# EAGLE design alt-promo (EAGLE 5.10)
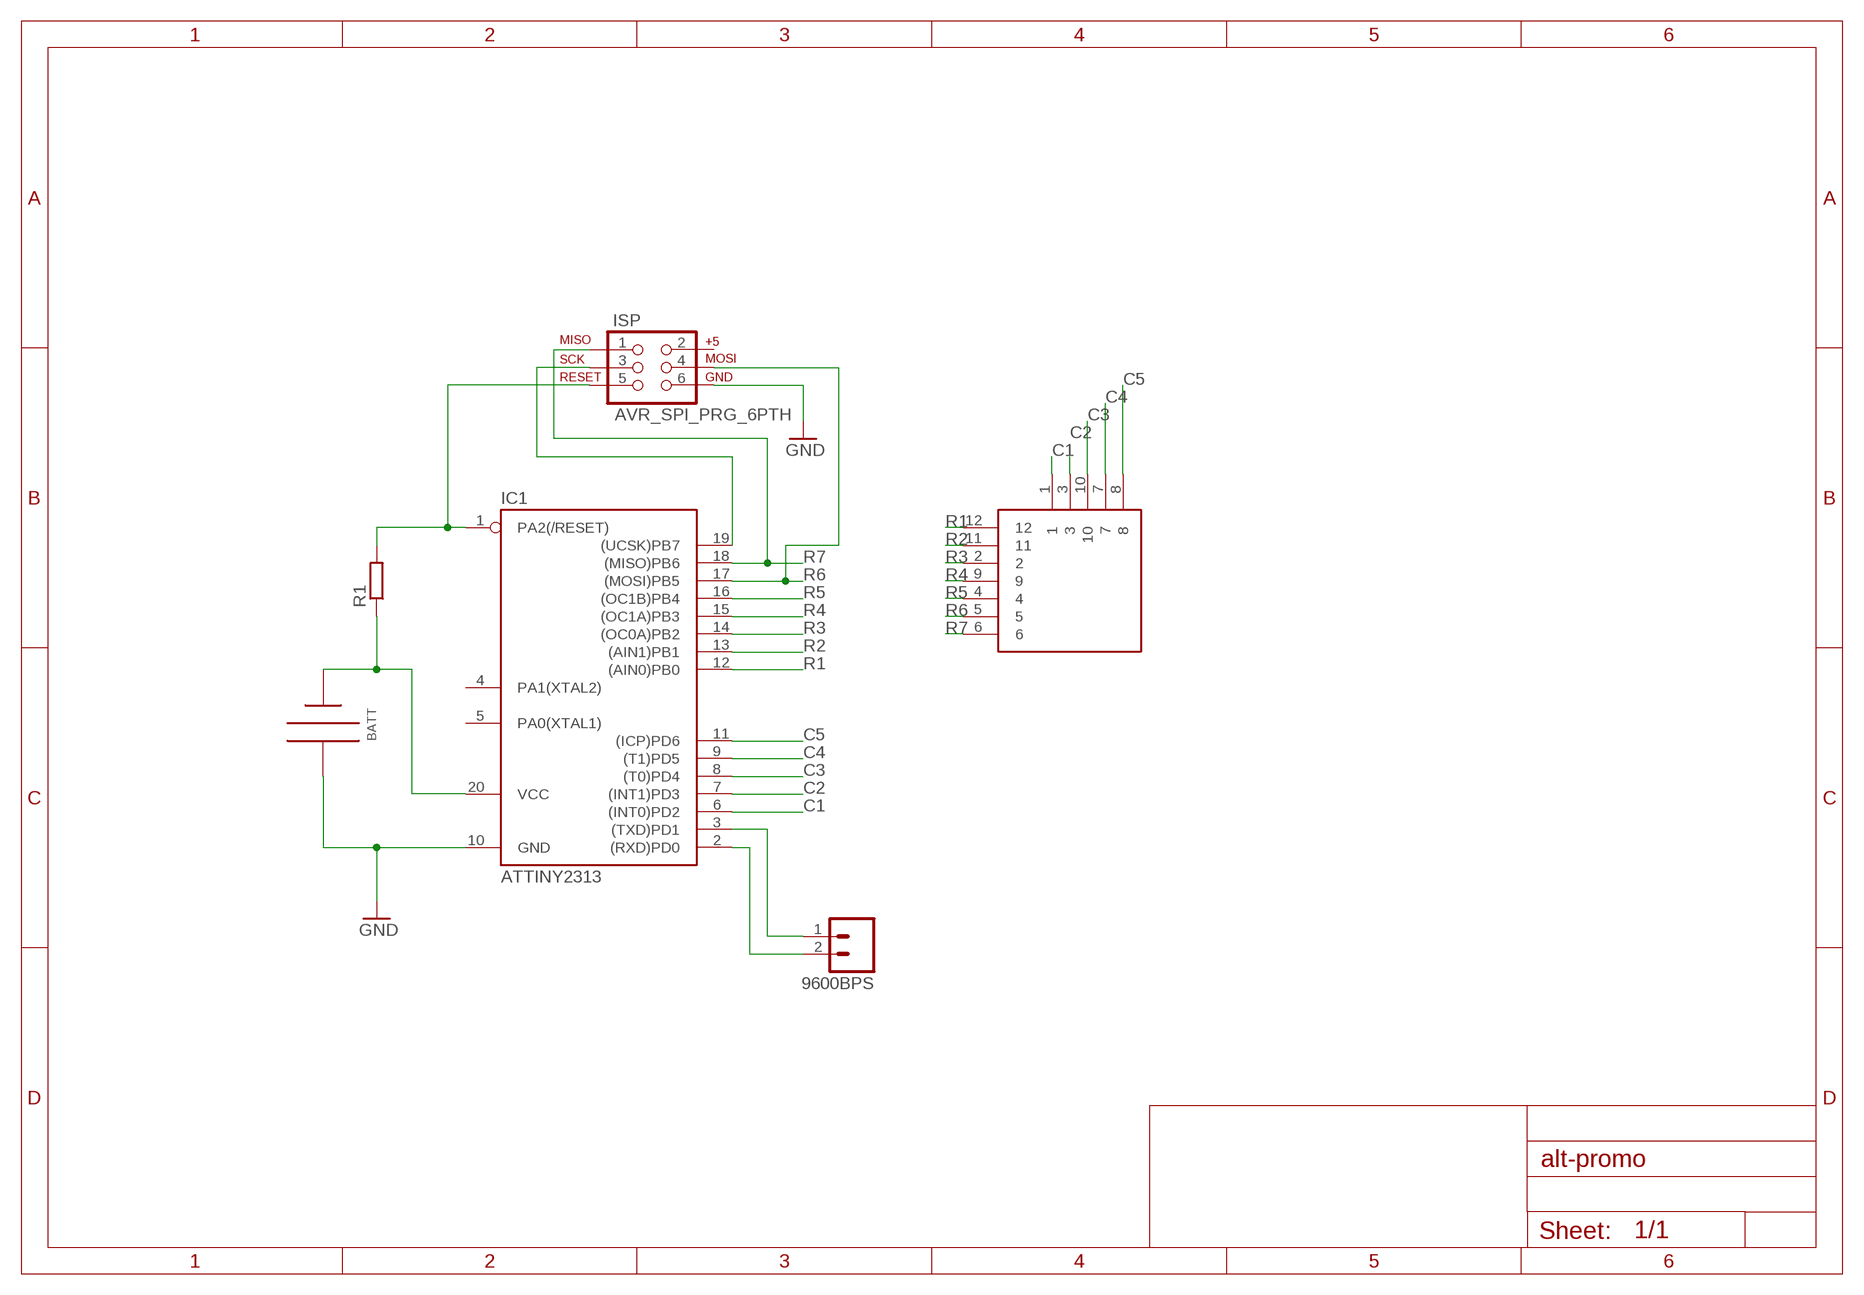
[diagram p0: schematic, sheet 1]

## Parts
9600BPS  M02PTH  [1X02]
IC1  ATTINY2313  TINY2313-*P*  [DIL20]
ISP  AVR_SPI_PRG_6PTH  [2X3]
LED  LED_MATRIX_1.9MM_5X7  [LED_MATRIX_5X7_1.9MM]
R1  R-EU_0207/10  [0207/10]
U$1  BAT_HOLDER_20MM  [BAT_HOLDER_20MM_VERT]

## Nets
C1: IC1.6((INT0)PD2) LED.1
C2: IC1.7((INT1)PD3) LED.3
C3: IC1.8((T0)PD4) LED.10
C4: IC1.9((T1)PD5) LED.7
C5: IC1.11((ICP)PD6) LED.8
GND: IC1.10(GND) ISP.6 U$1.GND
N$1: IC1.20(VCC) R1.1 U$1.VCC
N$3: IC1.1(PA2(/RESET)) ISP.5 R1.2
N$5: IC1.19((UCSK)PB7) ISP.3
N$6: 9600BPS.2 IC1.2((RXD)PD0)
N$7: 9600BPS.1 IC1.3((TXD)PD1)
R1: IC1.12((AIN0)PB0) LED.12
R2: IC1.13((AIN1)PB1) LED.11
R3: IC1.14((OC0A)PB2) LED.2
R4: IC1.15((OC1A)PB3) LED.9
R5: IC1.16((OC1B)PB4) LED.4
R6: IC1.17((MOSI)PB5) ISP.4 LED.5
R7: IC1.18((MISO)PB6) ISP.1 LED.6
Unconnected: IC1.4(PA1(XTAL2)) IC1.5(PA0(XTAL1)) ISP.2

## Library data of the parts
9600BPS = SparkFun:M02: Header 2 Standard 2-pin 0.1" header. Use with straight break away headers (SKU : PRT-00116), right angle break away headers (PRT-00553), swiss pins (PRT-00743), machine pins (PRT-00117), and female headers (PRT-00115). Molex polarized connector foot print use with SKU : PRT-08233 with associated crimp pins and housings.
IC1 = avr-6:TINY2313*: Atmel Tiny2313 2K Flash, 128 bytes EEPROM, 128 bytes RAM
ISP = SparkFun:AVR_SPI_PRG_6: AVR ISP 6 Pin This is the reduced ISP connector for AVR programming. Common on Arduino. This footprint will take up less PCB space and can be used with a 10-pin to 6-pin adapter such as SKU: BOB-08508
LED = sivu:LED_MATRIX_1.9MM_5X7
R1 = resistor:R-EU_: RESISTOR, European symbol
U$1 = sivu:BAT_HOLDER_20MM

## Net classes
0 default: width 0.254 mm, drill 0.254 mm, clearance 0.254 mm

## Board
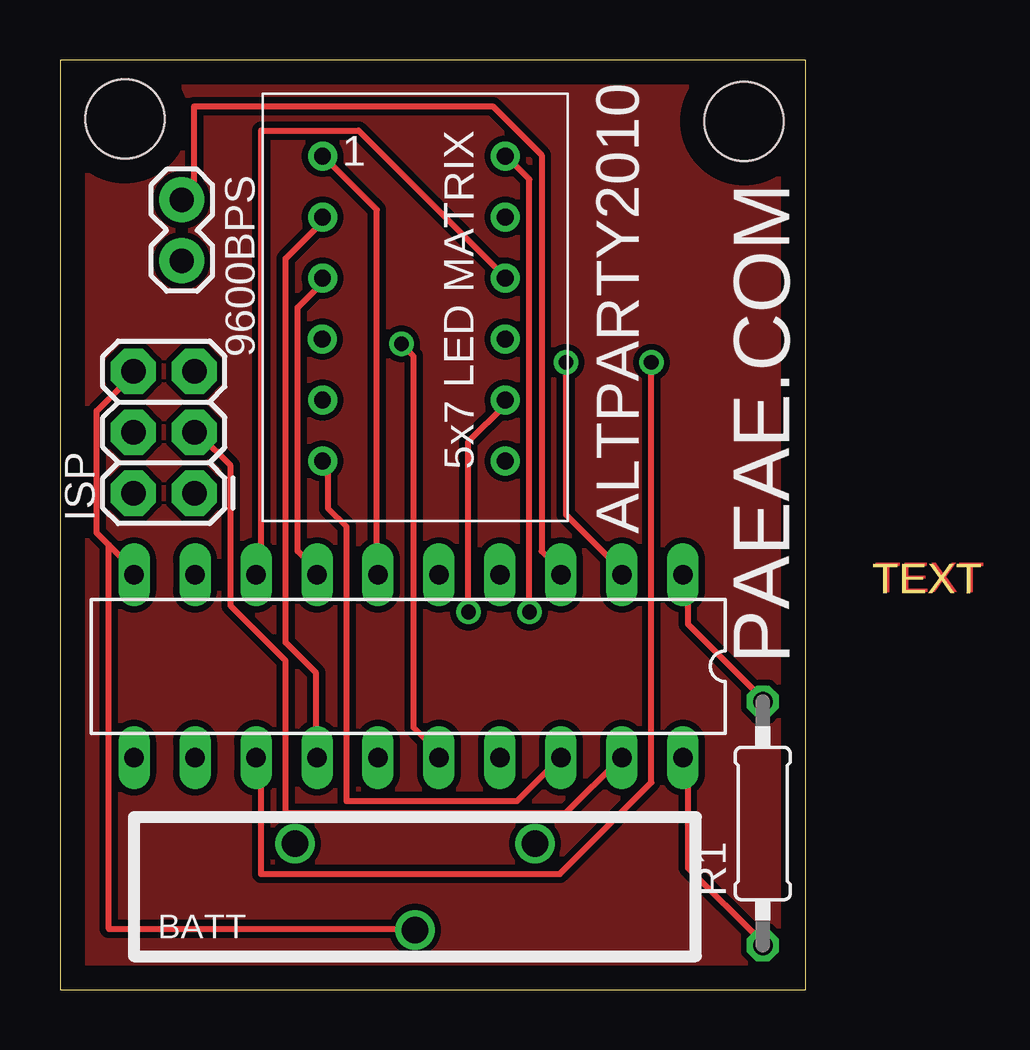
[diagram p1: board, top side]
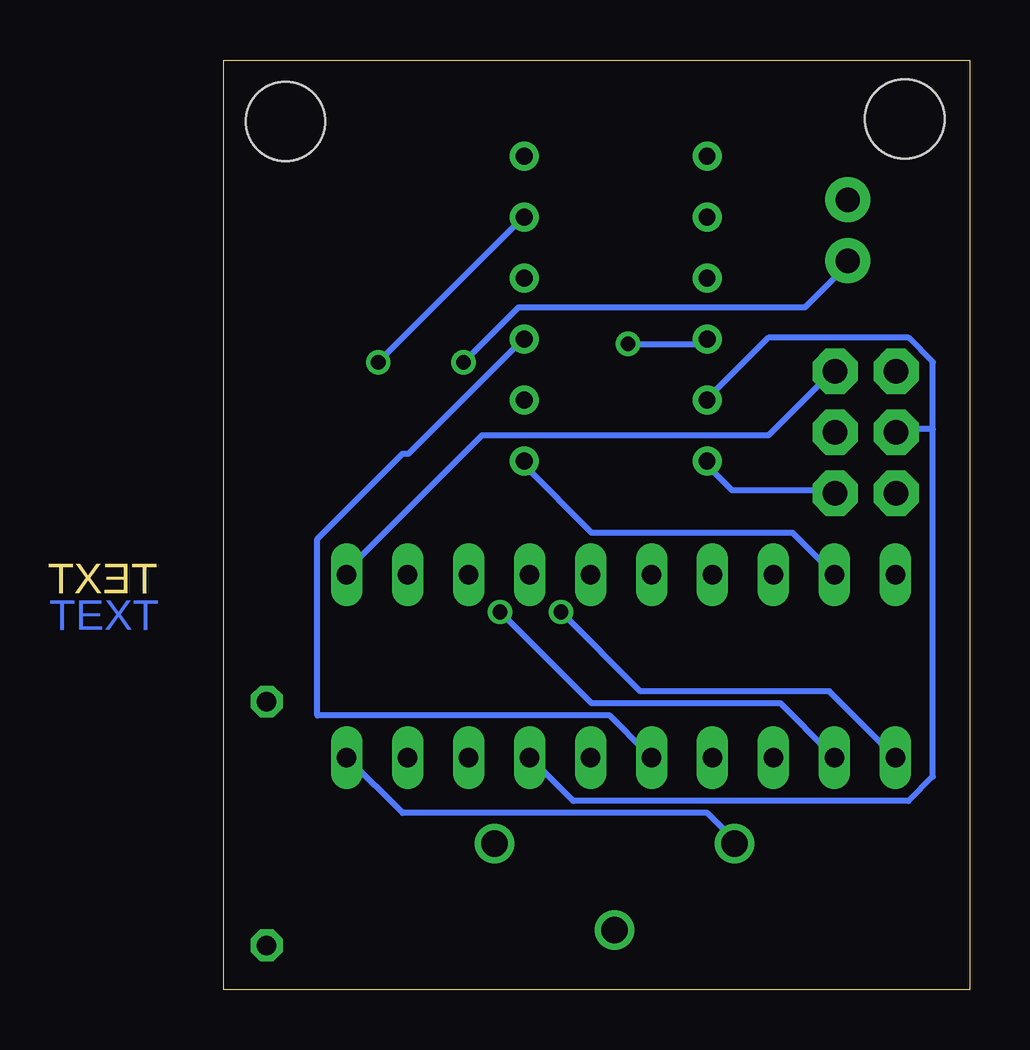
[diagram p2: board, bottom side, seen from below]

Size 31.08 x 38.77 mm. Coordinates in mm from the lower left corner, seen from the top.
Outline: 0,0.01 31.08,0 31.08,38.76 0,38.77 0,0.01
Copper layers (1*16): Top 0.035mm / dielectric 1.5mm / Bottom 0.035mm
Design rules "10mils": minimum track width 10mil, minimum drill 24mil, track to track 10mil, track to pad 10mil, pad to pad 10mil, via to via 10mil, smd to smd 10mil, copper to edge 40mil, drill to drill 10mil, minimum pad ring 10mil, minimum via ring 8mil, stop-mask expansion 0mil, vias tented up to drill 0mil, thermal gap 10mil
Holes 3.3 mm at 2.7,36.31 28.5,36.21

### Footprints (pad centres in the part's own frame; a part is rotated, then mirrored left to right if it is on the bottom)
1X02 = drill 1.016 pad 1.88 round: 1 0,0; 2 2.54,0
DIL20 = drill 0.813 long: 1 -11.43,-3.81; 2 -8.89,-3.81; 3 -6.35,-3.81; 4 -3.81,-3.81; 5 -1.27,-3.81; 6 1.27,-3.81; 7 3.81,-3.81; 8 6.35,-3.81; 9 8.89,-3.81; 10 11.43,-3.81; 11 11.43,3.81; 12 8.89,3.81; 13 6.35,3.81; 14 3.81,3.81; 15 1.27,3.81; 16 -1.27,3.81; 17 -3.81,3.81; 18 -6.35,3.81; 19 -8.89,3.81; 20 -11.43,3.81
2X3 = drill 1.016 pad 1.88 octagon: 1 0,0; 2 0,2.54; 3 2.54,0; 4 2.54,2.54; 5 5.08,0; 6 5.08,2.54
LED_MATRIX_5X7_1.9MM = drill 0.7 round: 1 -3.81,6.35; 2 -3.81,3.81; 3 -3.81,1.27; 4 -3.82,-1.27; 5 -3.81,-3.81; 6 -3.81,-6.35; 7 3.81,-6.35; 8 3.81,-3.81; 9 3.8,-1.27; 10 3.81,1.27; 11 3.81,3.81; 12 3.81,6.35
0207/10 = drill 0.813 octagon: 1 -5.08,0; 2 5.08,0
BAT_HOLDER_20MM_VERT = drill 1.1 round: GND 1.1,11.7; NC 4.7,6.7; VCC 4.7,16.7

### Placement (x,y rotation side)
9600BPS  5.08,32.94 270 top
IC1  14.52,13.5 180 top
ISP  5.6,20.71 90 top
LED  14.75,28.41 0 top
R1  29.28,6.94 90 top
U$1  26.49,1.41 90 top

### Tracks (layer width: path | path; a pad name or v marks a point on that pad's centre or on a via)
C1
  Top 0.254: LED.1 11.18,34.55 13.21,32.52 13.21,17.54 IC1.6
C2
  Top 0.254: LED.3 10.92,29.47 9.91,28.46 9.91,18.3 10.67,17.54 IC1.7
C3
  Top 0.254: LED.10 18.54,29.73 12.45,35.82 8.38,35.82 8.38,17.54 IC1.8
C4
  Bottom 0.254: LED.7 18.54,21.85 15.75,19.06 7.37,19.06 5.84,17.54 IC1.9
C5  (via drill 0.61)
  Top 0.254: v17.02,15.76 17.02,22.87 18.54,24.39 LED.8
  Bottom 0.254: v17.02,15.76 13.72,12.46 5.84,12.46 3.3,9.92 IC1.11
GND
  Top 0.254: 2.03,18.55 1.52,19.06 1.52,24.14 3.05,25.66 ISP.6 | 2.03,18.55 3.05,17.54 IC1.10 | 2.03,18.55 2.03,2.55 14.73,2.55 U$1.GND
N$1
  Top 0.254: R1.1 29.21,2.04 26.16,5.09 26.16,9.66 IC1.20
  Bottom 0.254: U$1.VCC 9.91,6.36 10.92,7.38 23.62,7.38 25.91,9.66 IC1.20
N$2
  pour Top: 0,38.73 31.14,38.73 31.14,0.01 0,0.01
N$3
  Top 0.254: R1.2 29.21,12.2 26.16,15.25 26.16,17.28 IC1.1
  Bottom 0.254: ISP.5 5.84,25.66 8.38,23.12 20.32,23.12 25.91,17.54 IC1.1
N$5
  Top 0.254: IC1.19 23.37,9.66 21.08,7.38 9.4,7.38 9.4,13.73 7.11,16.01 7.11,21.85 5.84,23.12 ISP.3
N$6  (via drill 0.61)
  Top 0.254: v21.08,26.17 21.08,19.82 23.37,17.54 IC1.2
  Bottom 0.254: v21.08,26.17 18.8,28.46 6.86,28.46 5.08,30.24 9600BPS.2
N$7
  Top 0.254: IC1.3 20.83,17.54 20.07,18.3 20.07,34.81 18.03,36.84 5.59,36.84 5.59,33.54 5.08,33.03 9600BPS.1
R1  (via drill 0.61)
  Top 0.254: v19.56,15.76 19.56,33.79 18.8,34.55 LED.12
  Bottom 0.254: v19.56,15.76 15.75,11.95 7.87,11.95 5.84,9.92 IC1.12
R2  (via drill 0.61)
  Top 0.254: v24.64,26.17 24.64,8.65 20.83,4.84 8.38,4.84 8.38,9.66 IC1.13
  Bottom 0.254: v24.64,26.17 18.8,32.01 LED.11
R3
  Top 0.254: LED.2 10.92,32.01 9.4,30.49 9.4,14.49 10.67,13.22 10.67,9.92 IC1.14
R4
  Bottom 0.254: LED.9 18.8,26.93 23.37,22.36 23.62,22.36 27.18,18.81 27.18,11.44 14.99,11.44 13.46,9.92 IC1.15
R5  (via drill 0.61)
  Top 0.254: v14.22,26.93 14.73,26.43 14.73,10.93 15.75,9.92 IC1.16
  Bottom 0.254: v14.22,26.93 11.18,26.93 LED.4
R6
  Bottom 0.254: 1.52,23.38 1.52,26.17 2.54,27.19 8.38,27.19 10.92,24.65 LED.5 | 1.52,23.38 3.05,23.38 ISP.4 | 1.52,23.38 1.52,8.9 2.54,7.88 16.51,7.88 18.29,9.66 IC1.17
R7
  Top 0.254: IC1.18 20.83,9.66 19.05,7.88 11.94,7.88 11.94,19.31 11.18,20.08 11.18,21.85 LED.6
  Bottom 0.254: LED.6 10.92,21.85 9.91,20.84 5.84,20.84 ISP.1

### Text on the board
Top: TEXT
Bottom: TEXT
Pads: TEXT
Vias: TEXT
Dimension: TEXT
tOrigins: TEXT | TEXT
tNames: ALTPARTY2010 | PAEAE.COM | BATT
tValues: TEXT